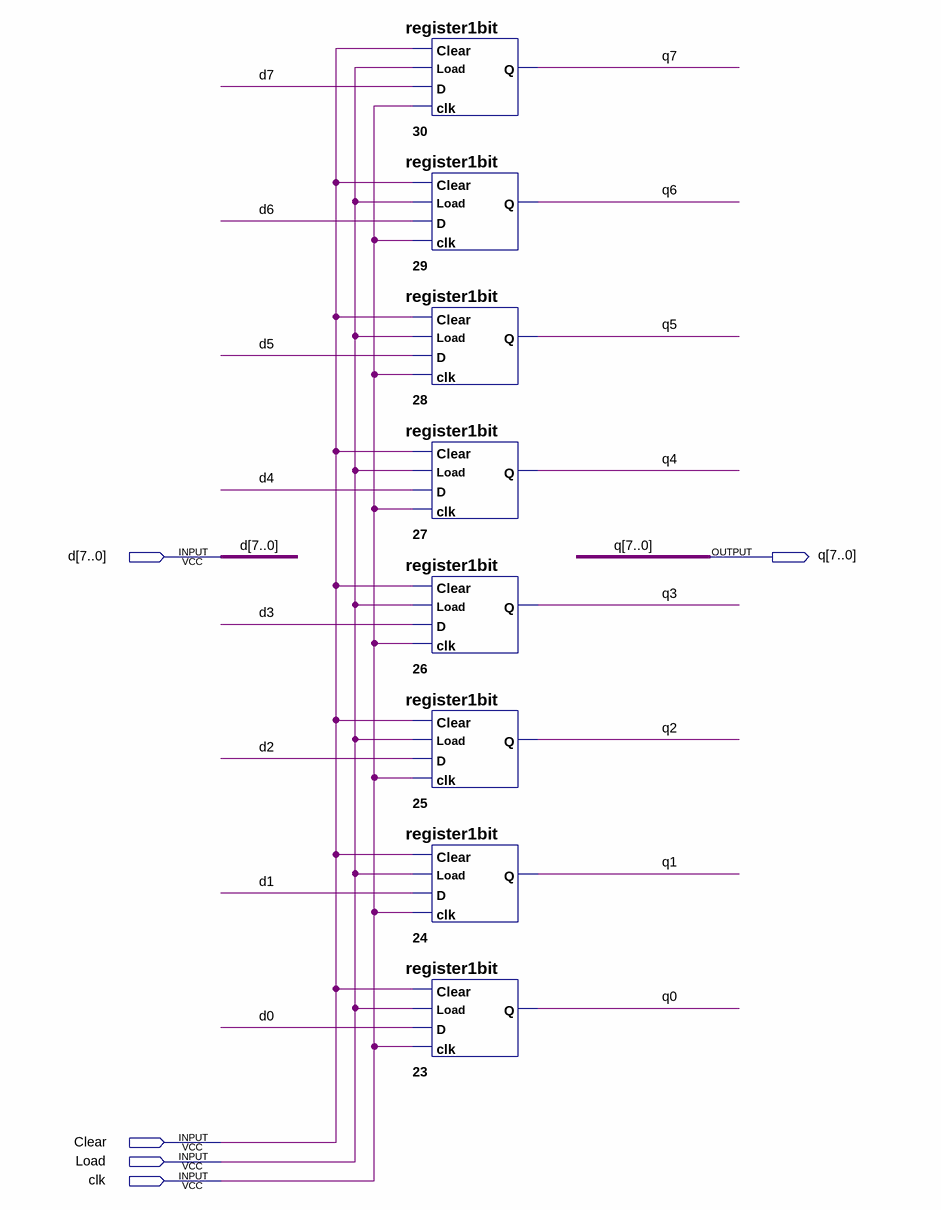
[diagram p0: schematic sheet]
// Quartus schematic register8bits.bdf as structural Verilog: 8 symbols, 5 pins
module register8bits (
  input  [7:0] d,
  input  Clear,
  input  Load,
  input  clk,
  output [7:0] q
);

  register1bit u_30 (.Clear(Clear), .Load(Load), .D(d[7]), .clk(clk), .Q(q[7]));
  register1bit u_29 (.Clear(Clear), .Load(Load), .D(d[6]), .clk(clk), .Q(q[6]));
  register1bit u_28 (.Clear(Clear), .Load(Load), .D(d[5]), .clk(clk), .Q(q[5]));
  register1bit u_27 (.Clear(Clear), .Load(Load), .D(d[4]), .clk(clk), .Q(q[4]));
  register1bit u_26 (.Clear(Clear), .Load(Load), .D(d[3]), .clk(clk), .Q(q[3]));
  register1bit u_25 (.Clear(Clear), .Load(Load), .D(d[2]), .clk(clk), .Q(q[2]));
  register1bit u_24 (.Clear(Clear), .Load(Load), .D(d[1]), .clk(clk), .Q(q[1]));
  register1bit u_23 (.Clear(Clear), .Load(Load), .D(d[0]), .clk(clk), .Q(q[0]));
endmodule
